# Altium schematic sheet exhaust-fan-control-circuit.SchDoc
size A4
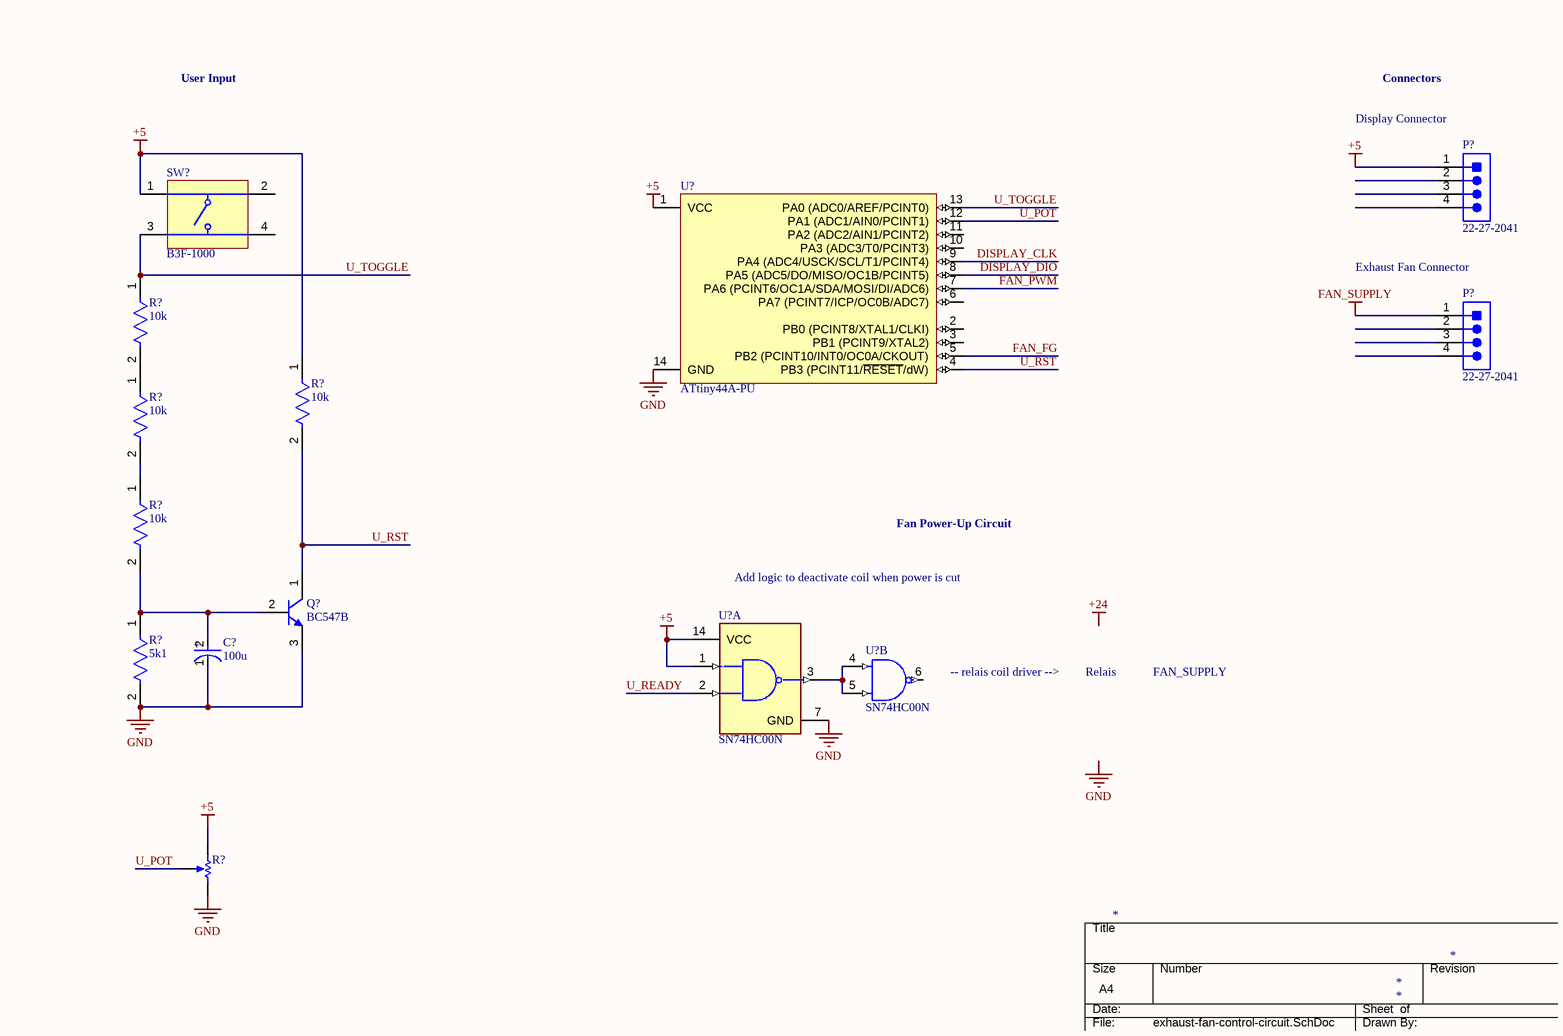
[diagram p0: exhaust-fan-control-circuit.SchDoc]

## Parts
(Parts that share a designator on the sheet are numbered #1, #2 ... from top to bottom, then left to right.)
C?  100u  [FP-UHW1E222MHD-MFG]
P?#1  22-27-2041  [MOLX-22-27-2041_V]
P?#2  22-27-2041  [MOLX-22-27-2041_V]
Q?  BC547B  [ONSC-TO-92-3-29-11]
R?#1  10k  [FP-CFR-25-MFG]
R?#2  10k  [FP-CFR-25-MFG]
R?#3  10k  [FP-CFR-25-MFG]
R?#4  10k  [FP-CFR-25-MFG]
R?#5  5k1  [FP-CFR-25-MFG]
R?#6  Potentiometer  (value not drawn)
SW?  B3F-1000  [OMRON-B3F-1000-4_V]
U?#1  ATtiny44A-PU  [14P3]
U?#2  SN74HC00N  [FP-N0014A-MFG]  (part A of 4)
U?#3  SN74HC00N  [FP-N0014A-MFG]  (part B of 4)

## Nets
+5: P?#1.1 R?#2.1 R?#6.1(TOP) SW?.1 U?#1.1(VCC) U?#2.1(1A) U?#2.14(VCC)
FAN_SUPPLY: P?#2.1
GND: C?.1(C) Q?.3(E) R?#5.2 R?#6.2(BOT) U?#1.14(GND) U?#2.7(GND)
DISPLAY_CLK: U?#1.9(PA4_(ADC4/USCK/SCL/T1/PCINT4))
DISPLAY_DIO: U?#1.8(PA5_(ADC5/DO/MISO/OC1B/PCINT5))
FAN_FG: U?#1.5(PB2_(PCINT10/INT0/OC0A/CKOUT))
FAN_PWM: U?#1.7(PA6_(PCINT6/OC1A/SDA/MOSI/DI/ADC6))
U_POT: R?#6.3(TAP) U?#1.12(PA1_(ADC1/AIN0/PCINT1))
U_READY: U?#2.2(1B)
U_RST: Q?.1(C) R?#2.2 U?#1.4(PB3_(PCINT11/~{RESET}/dW))
U_TOGGLE: R?#1.1 SW?.3 U?#1.13(PA0_(ADC0/AREF/PCINT0))
NetC?_2: C?.2(A) Q?.2(B) R?#4.2 R?#5.1
NetR?#1_2: R?#1.2 R?#3.1
NetR?#3_2: R?#3.2 R?#4.1
NetU?#2_3: U?#2.3(1Y) U?#3.4(2A) U?#3.5(2B)

Not connected (* = marked no-connect by the designer): P?#1 2 3 4; P?#2 2 3 4; SW? 2 4; U?#1 2(PB0_(PCINT8/XTAL1/CLKI)) 3(PB1_(PCINT9/XTAL2)) 6(PA7_(PCINT7/ICP/OC0B/ADC7)) 10(PA3_(ADC3/T0/PCINT3)) 11(PA2_(ADC2/AIN1/PCINT2)); U?#3 6(2Y)

## Notes on the sheet
- User Input
- Connectors
- (near P?#1) Display Connector
- (near P?#2) Exhaust Fan Connector
- Add logic to deactivate coil when power is cut
- Fan Power-Up Circuit
- (near U?#3) -- relais coil driver -->
- Relais
- FAN_SUPPLY
- Labels drawn without touching a wire or pin: +24, GND
- DWG. NO.
- REV.
- SHT.
- THIS DOCUMENT AND THE DATA DISCLOSED HEREIN OR HEREWITH IS THE PROPERTY OF ALTIUM LIMITED AND MAY BE FREELY DISTRIBUTED IN WHOLE. NO RIGHTS ARE RESERVED OR EXPRESS OR IMPLIED WARANTEE GIVEN.
- REVISION
- DESCRIPTION
- DATE
- APPROVED
- ENG:
- APPROVALS
- PROJECT
- DSN:
- CHK:
- REFERENCE DOCUMENTS
- PROJECT REVISION:
- TITLE
- DOCUMENT REVISION:
- DESIGN ITEM:
- BOM:
- FAB DWG:
- PCB DWG:
- ASSY DWG:
- SCALE:
- SIZE
- B
- CAGE CODE
- FILE NAME
- DWG NO.
- SHEET
- OF
- REV
- (in symbol CMP-12462-000038-1) +

## Library data of the parts
C? = CMP-12462-000038-1: CAP ALUM 2200UF 20% 25V RADIAL; Capacitance: 2.2mF; Ripple Current: 3.2A; Impedance: 15mR; Life (Hours): 10000Hour; Tolerance: 20%; Packaging: Bulk; Case/Package: Radial; Min Operating Temperature: -40°C; Height - Seated (Max): 1.063inch; Max Operating Temperature: 105°C; Series: HW; Lead Pitch: 0.197inch; RoHS Compliant: Yes; Voltage Rating: 25V; Package Quantity: 100; Mount: Through Hole
P?#1 P?#2 = CMP-2000-05243-1: Male Header, Pitch 2.54 mm, 1 x 4 Position, Height 11.7 mm, Tail Length 3.56 mm, RoHS, Bulk; Manufacturer: Molex; Voltage rating: 250V; Current rating: 4A; Datasheet Version: Rev. F, 06/2009; Operating temperature: 0degCto+75degC; Contact material: Tinplatedbrass; Manufacturer URL: http://www.molex.com/; Housing material: Nylon(UL94V-0); Datasheet URL: http://www.molex.com/pdm_docs/sd/022272041_sd.pdf
Q? = CMP-1048-01467-1: Amplifier Transistor, NPN Silicon, 3-Pin TO-92, Bulk Box; Manufacturer: On Semiconductor; IC Continuous (A): 0.1; fT Min (MHz): 150; DatasheetVersion: Rev. 7; ComponentLink1URL: http://www.onsemi.com/; Polarity: NPN; RoHS: FALSE; ComponentLink1Description: Manufacturer URL; Packing: Bulk Box; PackageDescription: 3-Pin Transistor Outline, Body 4.825 x 3.685 mm, Pitch 1.27 mm; ComponentLink3URL: http://www.onsemi.cn/pub_link/Collateral/2N6426-D.PDF; ComponentLink2Description: Datasheet; PackageVersion: Rev. AM; PackageReference: TO-92-3-29-11_AM_SL; ComponentLink3Description: Package Specification; Mounting Technology: Through Hole; PartNumber: BC547B; ComponentLink2URL: http://www.onsemi.com/pub_link/Collateral/BC546-D.PDF
R?#1-R?#5 = CMP-03413-000009-1: RES 10 OHM 1/4W 5% AXIAL; Resistance: 10R; Temperature Coefficient: 500ppm/°C; Max Power Dissipation: 250mW; RoHS Compliant: Yes; Packaging: Bulk; Series: Carbon Film; Case/Package: Axial; Max Operating Temperature: 155°C; Min Operating Temperature: -55°C; Number of Terminations: 2; Length: 0.248inch; Resistor Type: Carbon Film; Tolerance: 5%; Package Quantity: 200
R?#6 = Potentiometer: value: 1k; position: 0.5; SimulationGenericComponent: True
SW? = CMP-1677-00002-1: Tactile Switch, SPST-NO, 0.05 A, 5 to 24 V, -25 to 70 degC, 4-Pin THD, RoHS, Bulk; Shielding: Shielded; Gender: Female; Capacitance: -45 f; Voltage Rating: 150 V; Current Rating: 1.5 A; Radiation Hardening: No; Contact Plating: Gold; Height: 14.99 mm; Min Operating Temperature: -40 degC; Packaging: Tray; ComponentLink2Description: Datasheet; ComponentLink1URL: http://www.omron.com/; Lead Pitch: 1.27 mm; RoHSCompliant: true; Pins: 8; PackageReference: B3F-1000; Width: 25.4 mm; Contact Material: Brass; ComponentLink2URL: http://www.omron.com/ecb/products/pdf/en-b3f.pdf; PackageDescription: 4-Pin Through Hole Device, Body 6 x 6 mm; DatasheetVersion: Jan-15; ComponentLink1Description: Manufacturer URL; Package Quantity: 1080; Mount: Through Hole; Length: 18.34 mm; Max Operating Temperature: 70 degC
U?#1 = CMP-0093-00042-2: 8-bit AVR Microcontroller,  20MHz, 1.8-5.5V, 4KB Flash, 256 Bytes EEPROM, 256 Bytes SRAM, 14-pin PDIP, Industrial Grade (-40°C to 85°C), Pb-Free; PackageVersion: revB, Oct-2010; ComponentLink3URL: http://www.atmel.com/dyn/resources/prod_documents/8183S.pdf; ComponentLink2Description: ATtiny24A/44A/84A Datasheet; ComponentLink2URL: http://www.atmel.com/dyn/resources/prod_documents/doc8183.pdf; ComponentLink3Description: ATtiny24A/44A/84A Summary; RevisionNote: DatasheetVersion updated. URLs added.; Code_JEDEC: MS-001-AA; DatasheetVersion: revD, Apr-2011; ComponentLink1URL: http://www.atmel.com/; PackageDescription: 14-Lead Plastic Dual In-Line, 300 mil/7.62 mm Wide Body (PDIP); ComponentLink1Description: Manufacturer URL; PackageReference: 14P3
U?#2 U?#3 = CMP-1627-00482-3: IC GATE NAND 4CH 2-INP 14DIP; Quiescent Current: 2uA; High Level Output Current: -5.2mA; Schmitt Trigger Input: No; Turn-On Delay Time: 20ns; Number of Input Lines: 2; Number of Elements: 4; Propagation Delay: 15ns; Low Level Output Current: 5.2mA; Operating Supply Voltage: 5V; Min Supply Voltage: 2V; Max Output Current: 4mA; Max Supply Voltage: 6V; Number of Outputs: 1; Width: 6.35mm; Case/Package: PDIP; Logic Function: NAND; Packaging: Rail/Tube; Number of Bits: 4; Weight: 0.032734oz; Mount: Through Hole; Length: 19.3mm; Contact Plating: Gold; Number of Inputs: 2; Radiation Hardening: No; Number of Pins: 14; Package Quantity: 25; Height: 4.57mm; Lead Free: Lead Free; Number of Circuits: 4; Output Current: 5.2mA; Min Operating Temperature: -40°C; REACH SVHC: No SVHC; Number of Output Lines: 1; Max Operating Temperature: 85°C; Number of Gates: 4